# EAGLE design motocontro_rev_4 (EAGLE 9.3.0)
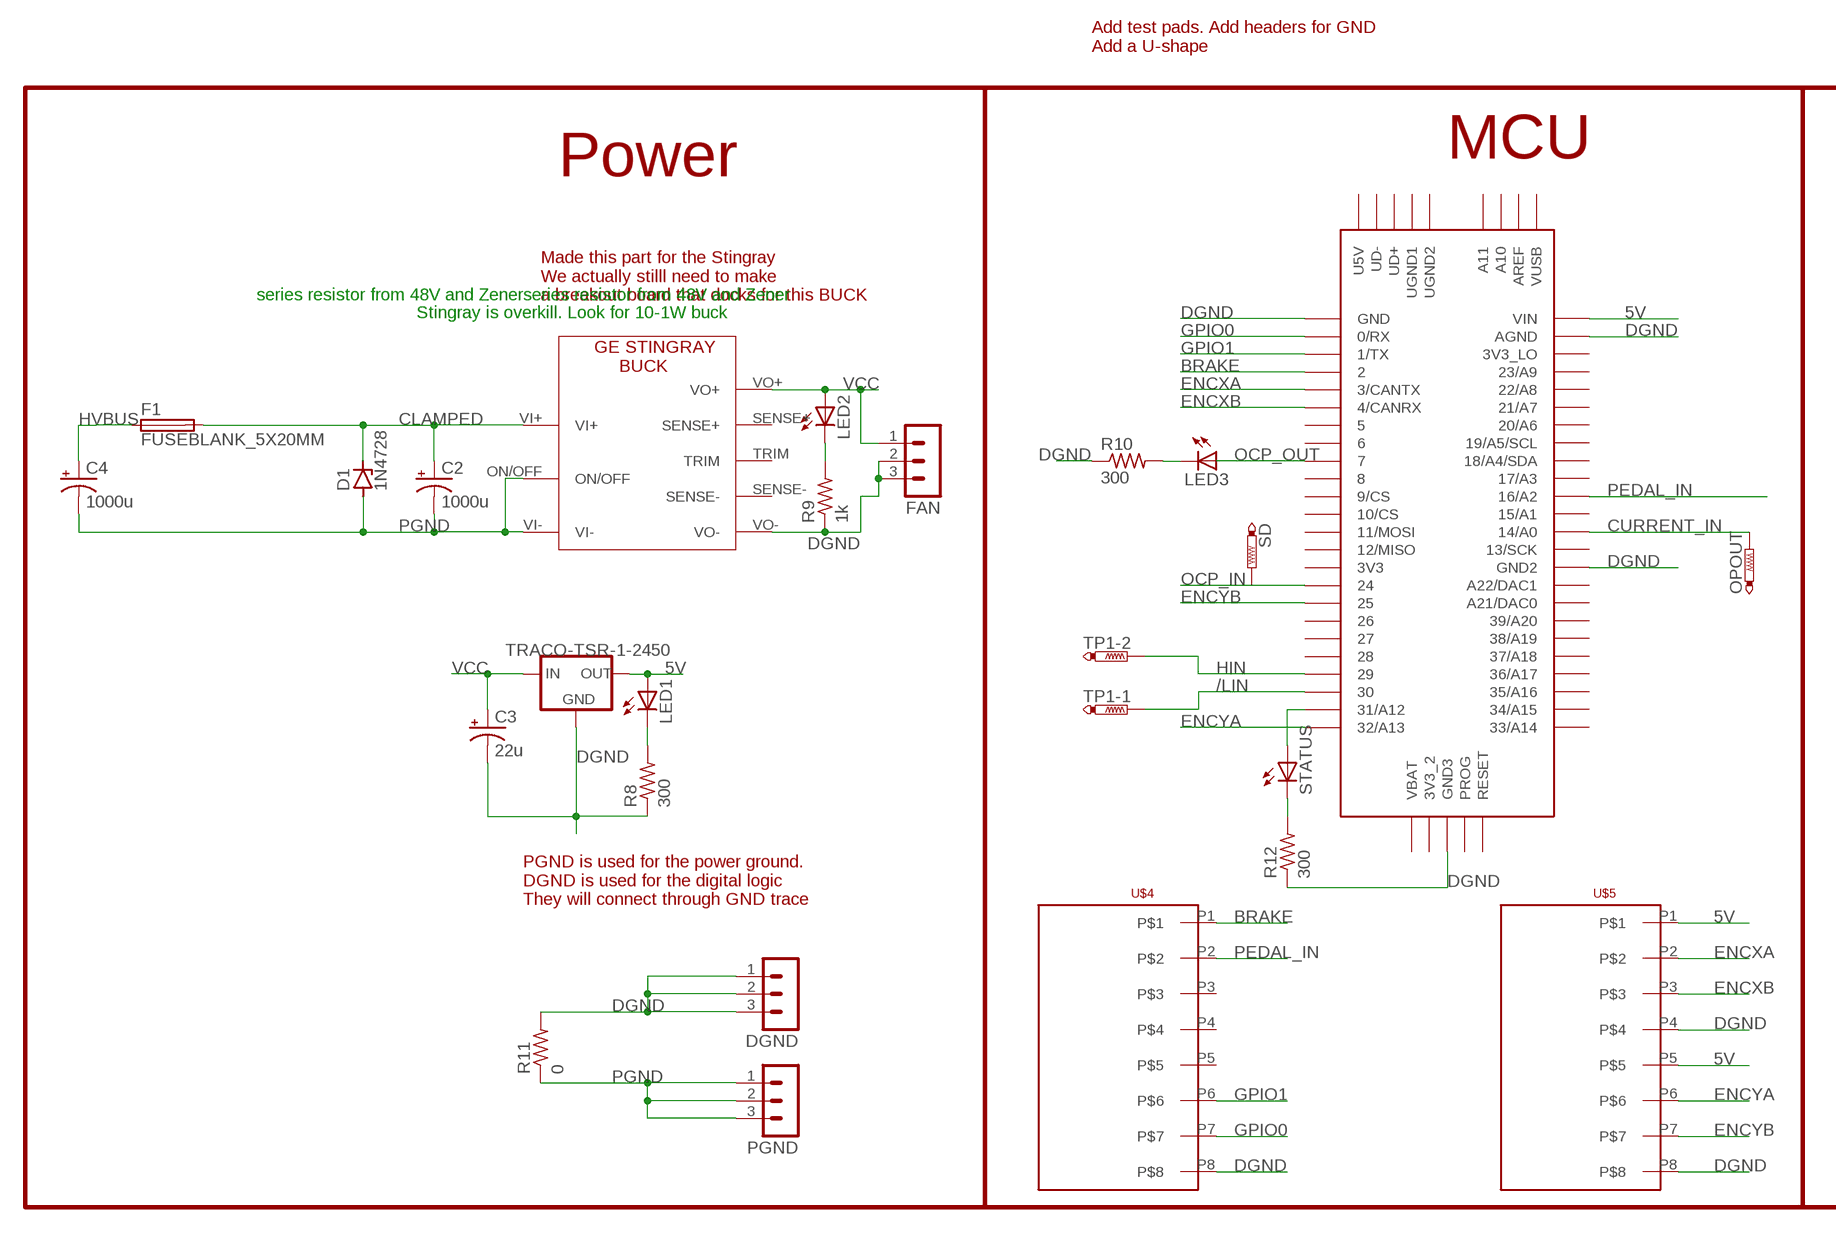
[diagram p0: schematic, sheet 1, part 1 of 2]
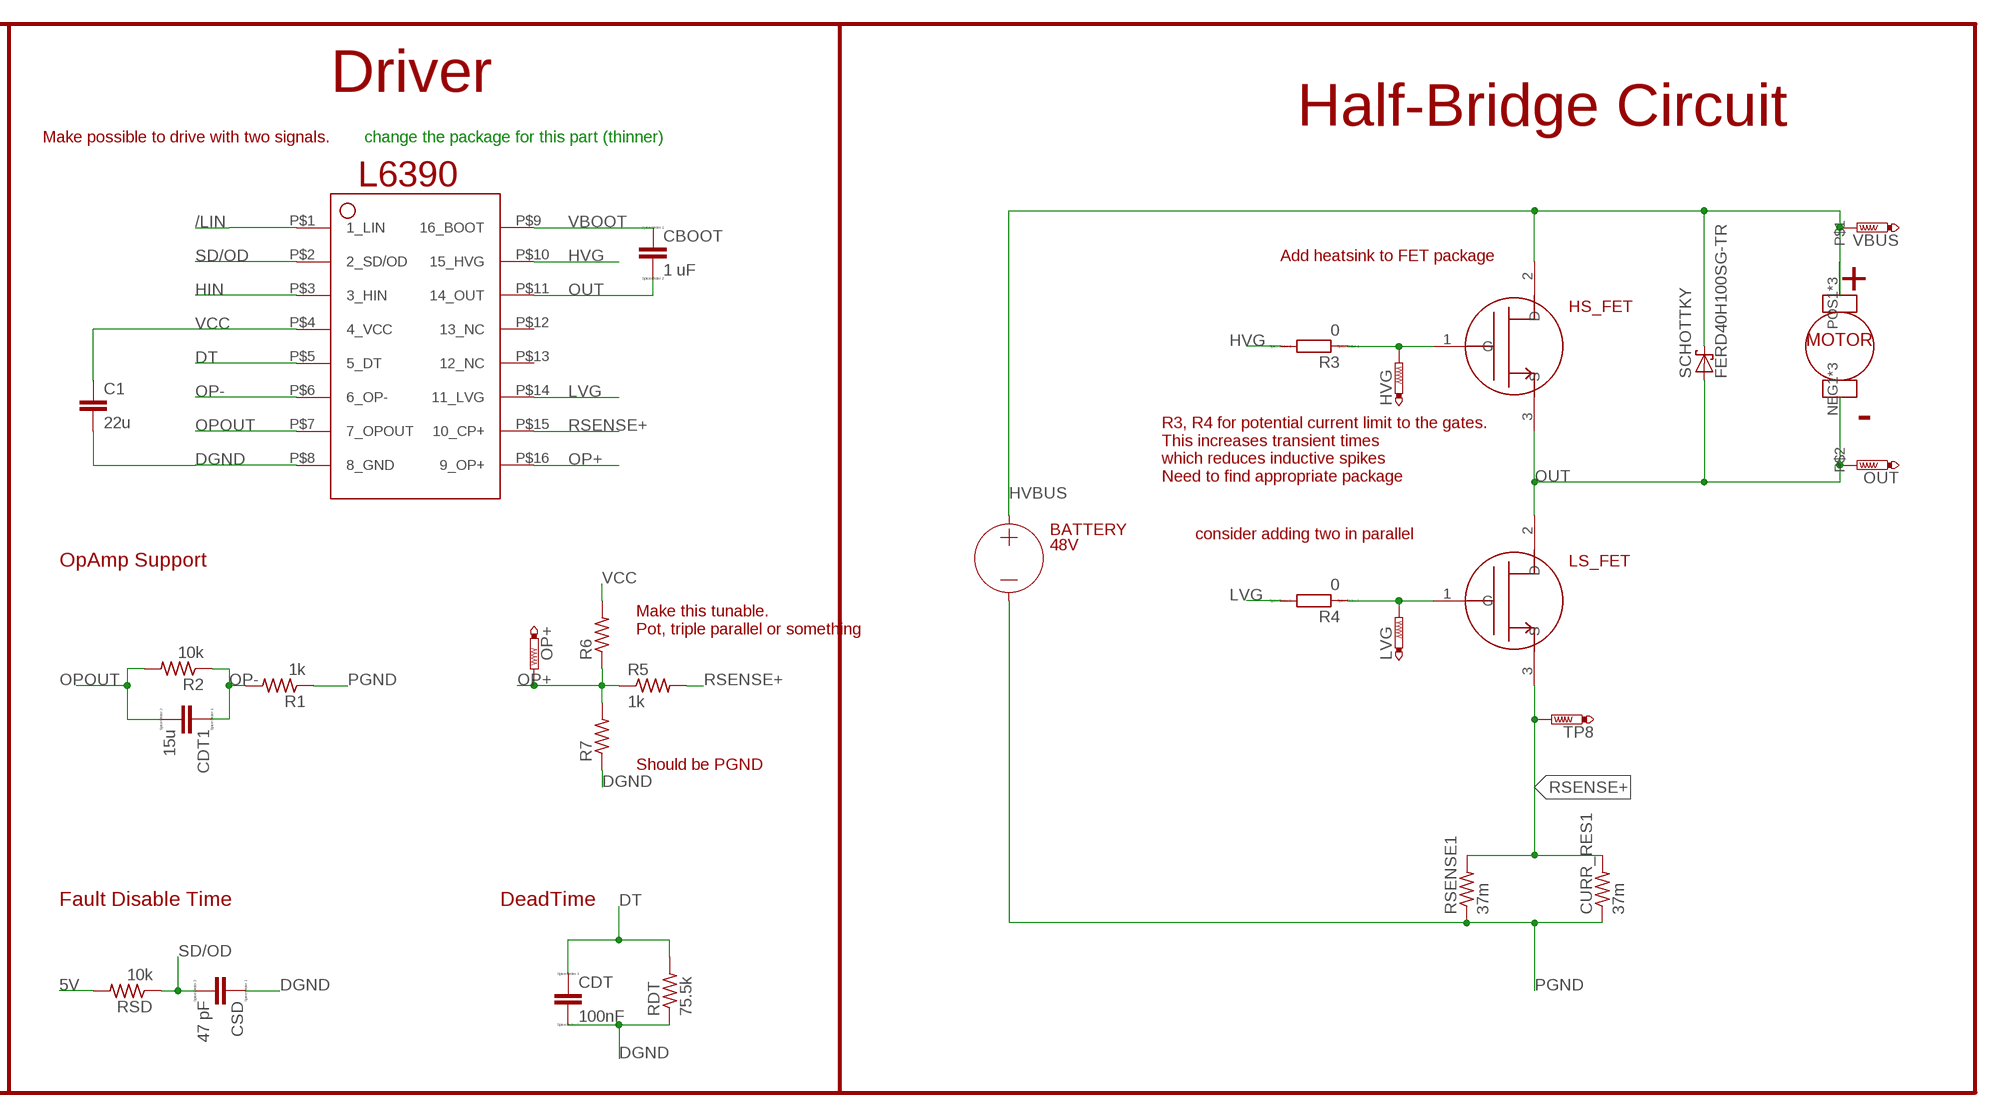
[diagram p1: schematic, sheet 1, part 2 of 2]

## Parts
BATTERY  48V  BATTERY  [SB50POWER_CLAW]
C1  22u  CAPACITOR_0805_M  [RESC0805_M]
C2  1000u  CPOL-USE5-13  [E5-13]
C3  22u  CPOL-US153CLV-0605  [153CLV-0605]
C4  1000u  CPOL-USE10-20  [EB20D]
CBOOT  1 uF  CC1206  [C1206]
CDT  100nF  CC1206  [C1206]
CDT1  15u  CC1206  [C1206]
CSD  47 pF  CC1206  [C1206]
CURR_RES1  37m  RESSENSE_2818  [2818_WITH_VIA]
D1  1N4728  [DO41Z10]
DGND  MA03-1  [MA03-1]
F1  FUSEBLANK_5X20MM  [FUSE_HOLDER_5X20MM]
FAN  MA03-1  [MA03-1]
HS_FET  FDB86360_NFETTO263/D2PAK  [TO-263/D2PAK]
HVG  PTR1B1,27  [B1,27]
LDO  TRACO-TSR-1-2450  [SIP3]
LED1  LEDCHIP-LED0805  [CHIP-LED0805]
LED2  LEDCHIP-LED0805  [CHIP-LED0805]
LED3  LEDCHIP-LED0805  [CHIP-LED0805]
LS_FET  FDB86360_NFETTO263/D2PAK  [TO-263/D2PAK]
LVG  PTR1B1,27  [B1,27]
MOTOR  MOTOR  [SB50POWER_CLAW]
OP+  PTR1B1,27  [B1,27]
OPOUT  PTR1B1,27  [B1,27]
OUT  PTR1B1,27  [B1,27]
PGND  MA03-1  [MA03-1]
R1  1k  R-US_R0805  [R0805]
R2  10k  R-US_R0805  [R0805]
R3  0  RR2012  [R2012]
R4  0  RR2012  [R2012]
R5  1k  R-US_R0805  [R0805]
R6  R-US_R0805  [R0805]
R7  R-US_R0805  [R0805]
R8  300  R-US_R0805  [R0805]
R9  1k  R-US_R0805  [R0805]
R10  300  R-US_R0805  [R0805]
R11  0  R-US_R0805  [R0805]
R12  300  R-US_R0805  [R0805]
RDT  75.5k  R-US_R0805  [R0805]
RSD  10k  R-US_R0805  [R0805]
RSENSE1  37m  RESSENSE_2818  [2818_WITH_VIA]
SCHOTTKY  FERD40H100SG-TR  [TO-263/D2PAK]
SD  PTR1B1,27  [B1,27]
STATUS  LEDCHIP-LED0805  [CHIP-LED0805]
TP1  PTR2  [P2-38-17]
TP8  PTR1B1,27  [B1,27]
U$1  L6390SO-16NARRROW  [SO-16NARROW]
U$2  TEENSY_3.5/3.6  [TEENSY_3.5/3.6]
U$3  GE_STINGRAY_H  [GE_STINGRAY]
U$4  8-PIN-MOLEX-RA-FEMALE  [8-PIN-MOLEX]
U$5  8-PIN-MOLEX-RA-FEMALE  [8-PIN-MOLEX]
VBUS  PTR1B1,27  [B1,27]

## Nets
5V: LDO.3(OUT) LED1.A RSD.2 U$2.VIN U$5.P1 U$5.P5
/LIN: TP1.TP-1 U$1.P$1(1_LIN) U$2.30
BRAKE: U$2.2 U$4.P1
CLAMPED: C2.+ D1.C F1.2 U$3.VI+
CURRENT_IN: OPOUT.TP U$2.14/A0
DGND: C1.2 C3.- CDT.2 CSD.1 DGND.1 DGND.2 DGND.3 FAN.2 FAN.3 LDO.2(GND) R7.1 R8.1 R9.1 R10.1 R11.2 R12.1 RDT.1 U$1.P$8(8_GND) U$2.AGND U$2.GND U$2.GND2 U$2.GND3 U$3.VO- U$4.P8 U$5.P4 U$5.P8
DT: CDT.1 RDT.2 U$1.P$5(5_DT)
ENCXA: U$2.3/CANTX U$5.P2
ENCXB: U$2.4/CANRX U$5.P3
ENCYA: U$2.32/A13 U$5.P6
ENCYB: U$2.25 U$5.P7
GPIO0: U$2.0/RX U$4.P7
GPIO1: U$2.1/TX U$4.P6
HIN: TP1.TP-2 U$1.P$3(3_HIN) U$2.29
HVBUS: BATTERY.POS1(+) BATTERY.POS2(+) BATTERY.POS3(+) C4.+ F1.1 HS_FET.2(D) MOTOR.POS1 MOTOR.POS2 MOTOR.POS3 SCHOTTKY.2(C) VBUS.TP
HVG: R3.2 U$1.P$10(15_HVG)
LVG: R4.2 U$1.P$14(11_LVG)
N$1: LED1.C R8.2
N$2: HS_FET.1(G) HVG.TP R3.1
N$3: LS_FET.1(G) LVG.TP R4.1
N$4: STATUS.A U$2.31/A12
N$5: R12.2 STATUS.C
N$39: LED2.C R9.2
N$48: LED3.C R10.2
OCP_IN: SD.TP U$2.24
OCP_OUT: LED3.A U$2.7
OP+: OP+.TP R5.1 R6.1 R7.2 U$1.P$16(9_OP+)
OP-: CDT1.1 R1.2 R2.1 U$1.P$6(6_OP-)
OPOUT: CDT1.2 R2.2 U$1.P$7(7_OPOUT)
OUT: CBOOT.2 HS_FET.3(S) LS_FET.2(D) MOTOR.NEG1 MOTOR.NEG2 MOTOR.NEG3 OUT.TP SCHOTTKY.3(A) U$1.P$11(14_OUT)
PEDAL_IN: U$2.16/A2 U$4.P2
PGND: BATTERY.NEG1(-) BATTERY.NEG2(-) BATTERY.NEG3(-) C2.- C4.- CURR_RES1.P1.1 CURR_RES1.P$1 D1.A PGND.1 PGND.2 PGND.3 R1.1 R11.1 RSENSE1.P1.1 RSENSE1.P$1 U$3.ON/OFF U$3.VI-
RSENSE+: CURR_RES1.P2.2 CURR_RES1.P$2 LS_FET.3(S) R5.2 RSENSE1.P2.2 RSENSE1.P$2 TP8.TP U$1.P$15(10_CP+)
SD/OD: CSD.2 RSD.1 U$1.P$2(2_SD/OD)
VBOOT: CBOOT.1 U$1.P$9(16_BOOT)
VCC: C1.1 C3.+ FAN.1 LDO.1(IN) LED2.A R6.2 U$1.P$4(4_VCC) U$3.VO+
Unconnected: U$1.P$12(13_NC) U$1.P$13(12_NC) U$2.3V3 U$2.3V3_2 U$2.3V3_LO U$2.5 U$2.6 U$2.8 U$2.9/CS U$2.10/CS U$2.11/MOSI U$2.12/MISO U$2.13/SCK U$2.15/A1 U$2.17/A3 U$2.18/A4/SDA U$2.19/A5/SCL U$2.20/A6 U$2.21/A7 U$2.21/DAC0(A21/DAC0) U$2.22/A8 U$2.23/A9 U$2.26 U$2.27 U$2.28 U$2.33/A14 U$2.34/A15 U$2.35/A16 U$2.36/A17 U$2.37/A18 U$2.38/A19 U$2.39/A20 U$2.A10 U$2.A11 U$2.A22/DAC1 U$2.AREF U$2.PROG U$2.RESET U$2.U5V U$2.UD+ U$2.UD- U$2.UGND1 U$2.UGND2 U$2.VBAT U$2.VUSB U$3.SENSE+ U$3.SENSE- U$3.TRIM U$4.P3 U$4.P4 U$4.P5

## Notes on the sheet
- Add test pads. Add headers for GND
  Add a U-shape
- Power | MCU | Driver
- Half-Bridge Circuit
- Make possible to drive with two signals. | change the package for this part (thinner)
- series resistor from 48V and Zener | series resistor from 48V and Zener
- Made this part for the Stingray
  We actually stilll need to make
  a breakout board that docks for this BUCK
- Stingray is overkill. Look for 10-1W buck
- Add heatsink to FET package
- R3, R4 for potential current limit to the gates.
  This increases transient times
  which reduces inductive spikes
  Need to find appropriate package
- consider adding two in parallel
- OpAmp Support
- Make this tunable.
  Pot, triple parallel or something
- Should be PGND
- PGND is used for the power ground.
  DGND is used for the digital logic
  They will connect through GND trace
- Fault Disable Time | DeadTime

## Library data of the parts
BATTERY = Rev_motor_controller_3.02:BATTERY
C1 = Nordic_nRF:CAPACITOR: Generic chip capacitor
C2-C4 = adafruit:CPOL-US: POLARIZED CAPACITOR, American symbol
CBOOT CDT CDT1 CSD = eagle-ltspice:C: CAPACITOR, European symbol; SPICEMODEL: NONE; SPICEPREFIX: C
CURR_RES1 RSENSE1 = motocontro_rev_4:RESSENSE_2818
D1 = diode:1N4728: Z DIODE 3.3 V, 1W, 5 percent
DGND FAN PGND = con-lstb:MA03-1: PIN HEADER; OC_FARNELL: unknown; OC_NEWARK: unknown
F1 = fuse:FUSE: Fuse; OC_FARNELL: unknown; OC_NEWARK: unknown
HS_FET LS_FET = motocontro_rev_4:FDB86360_NFET
HVG LVG OP+ OPOUT OUT SD TP8 VBUS = testpad:PTR1: TEST PIN
LDO = r-78xx_10:TRACO-TSR-1-2450: An LDO from TRACO POWER
LED1-LED3 STATUS = adafruit:LED: LED OSRAM: - CHIPLED LG R971, LG N971, LY N971, LG Q971, LY Q971, LO R971, LY R971 LH N974, LH R974 LS Q976, LO Q976, LY Q976 LO Q996 - Hyper CHIPLED LW Q18S LB Q993, LB Q99A, LB R99A - SideLED LS A670, LO A670, LY A670, LG A670, LP A670 LB A673, LV A673, LT A673, LW A673 LH A674 LY A675 LS A676, LA A676, LO A676, LY A676, LW A676 LS A679, LY A679, LG A679 - Hyper Micro SIDELED® LS Y876, LA Y876, LO Y876, LY Y876 LT Y87S - SmartLED LW L88C, LW L88S LB L89C, LB L89S, LG L890 LS L89K, LO L89K, LY L89K LS L896, LA L896, LO L896, LY L896 - TOPLED LS T670, LO T670, LY T670, LG T670, LP T670 LSG T670, LSP T670, LSY T670, LOP T670, LYG T670 LG T671, LOG T671, LSG T671 LB T673, LV T673, LT T673, LW T673 LH T674 LS T676, LA T676, LO T676, LY T676, LB T676, LH T676, LSB T676, LW T676 LB T67C, LV T67C, LT T67C, LS T67K, LO T67K, LY T67K, LW E67C LS E67B, LA E67B, LO E67B, LY E67B, LB E67C, LV E67C, LT E67C LW T67C LS T679, LY T679, LG T679 LS T770, LO T770, LY T770, LG T770, LP T770 LB T773, LV T773, LT T773, LW T773 LH T774 LS E675, LA E675, LY E675, LS T675 LS T776, LA T776, LO T776, LY T776, LB T776 LHGB T686 LT T68C, LB T68C - Hyper Mini TOPLED® LB M676 - Mini TOPLED Santana® LG M470 LS M47K, LO M47K, LY M47K Source: http://www.osram.convergy.de/
MOTOR = Rev_motor_controller_3.02:MOTOR
R1 R2 R5-R12 RDT RSD = adafruit:R-US_: RESISTOR, American symbol
R3 R4 = eagle-ltspice:R: RESISTOR, European symbol; SPICEMODEL: NONE; SPICEPREFIX: R
SCHOTTKY = motocontro_rev_4:FERD40H100SG-TR: An IF= 40A, VF = 375mV-700mV, schottky diode in D2PAK
TP1 = testpad:PTR2: TEST PIN
U$1 = master_library:L6390
U$2 = Teensy356:TEENSY_3.5/3.6
U$3 = motocontro_rev_4:GE_STINGRAY_H
U$4 U$5 = master_library:8-PIN-MOLEX-RA-FEMALE

## Board
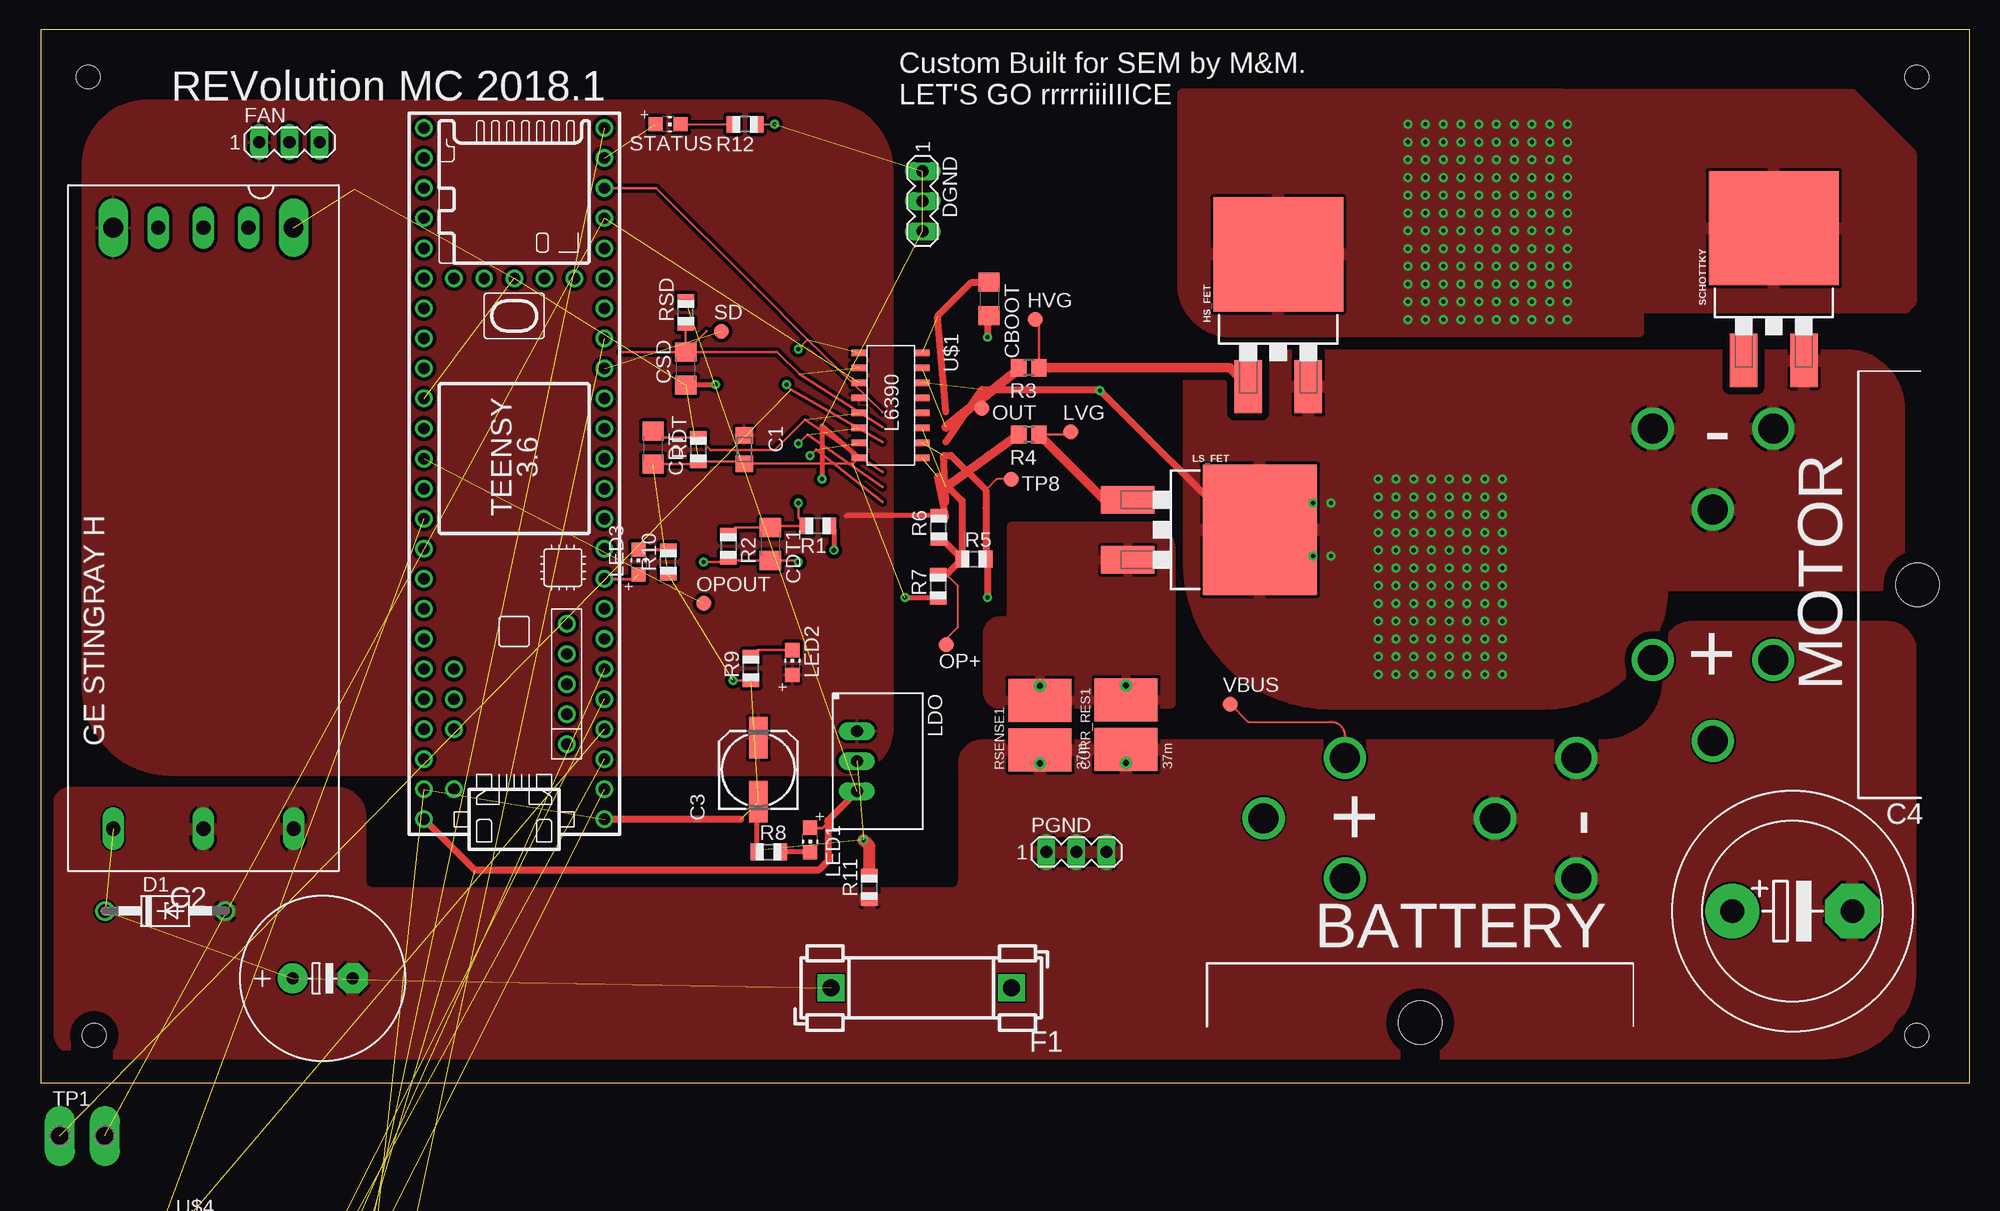
[diagram p2: board, top side]
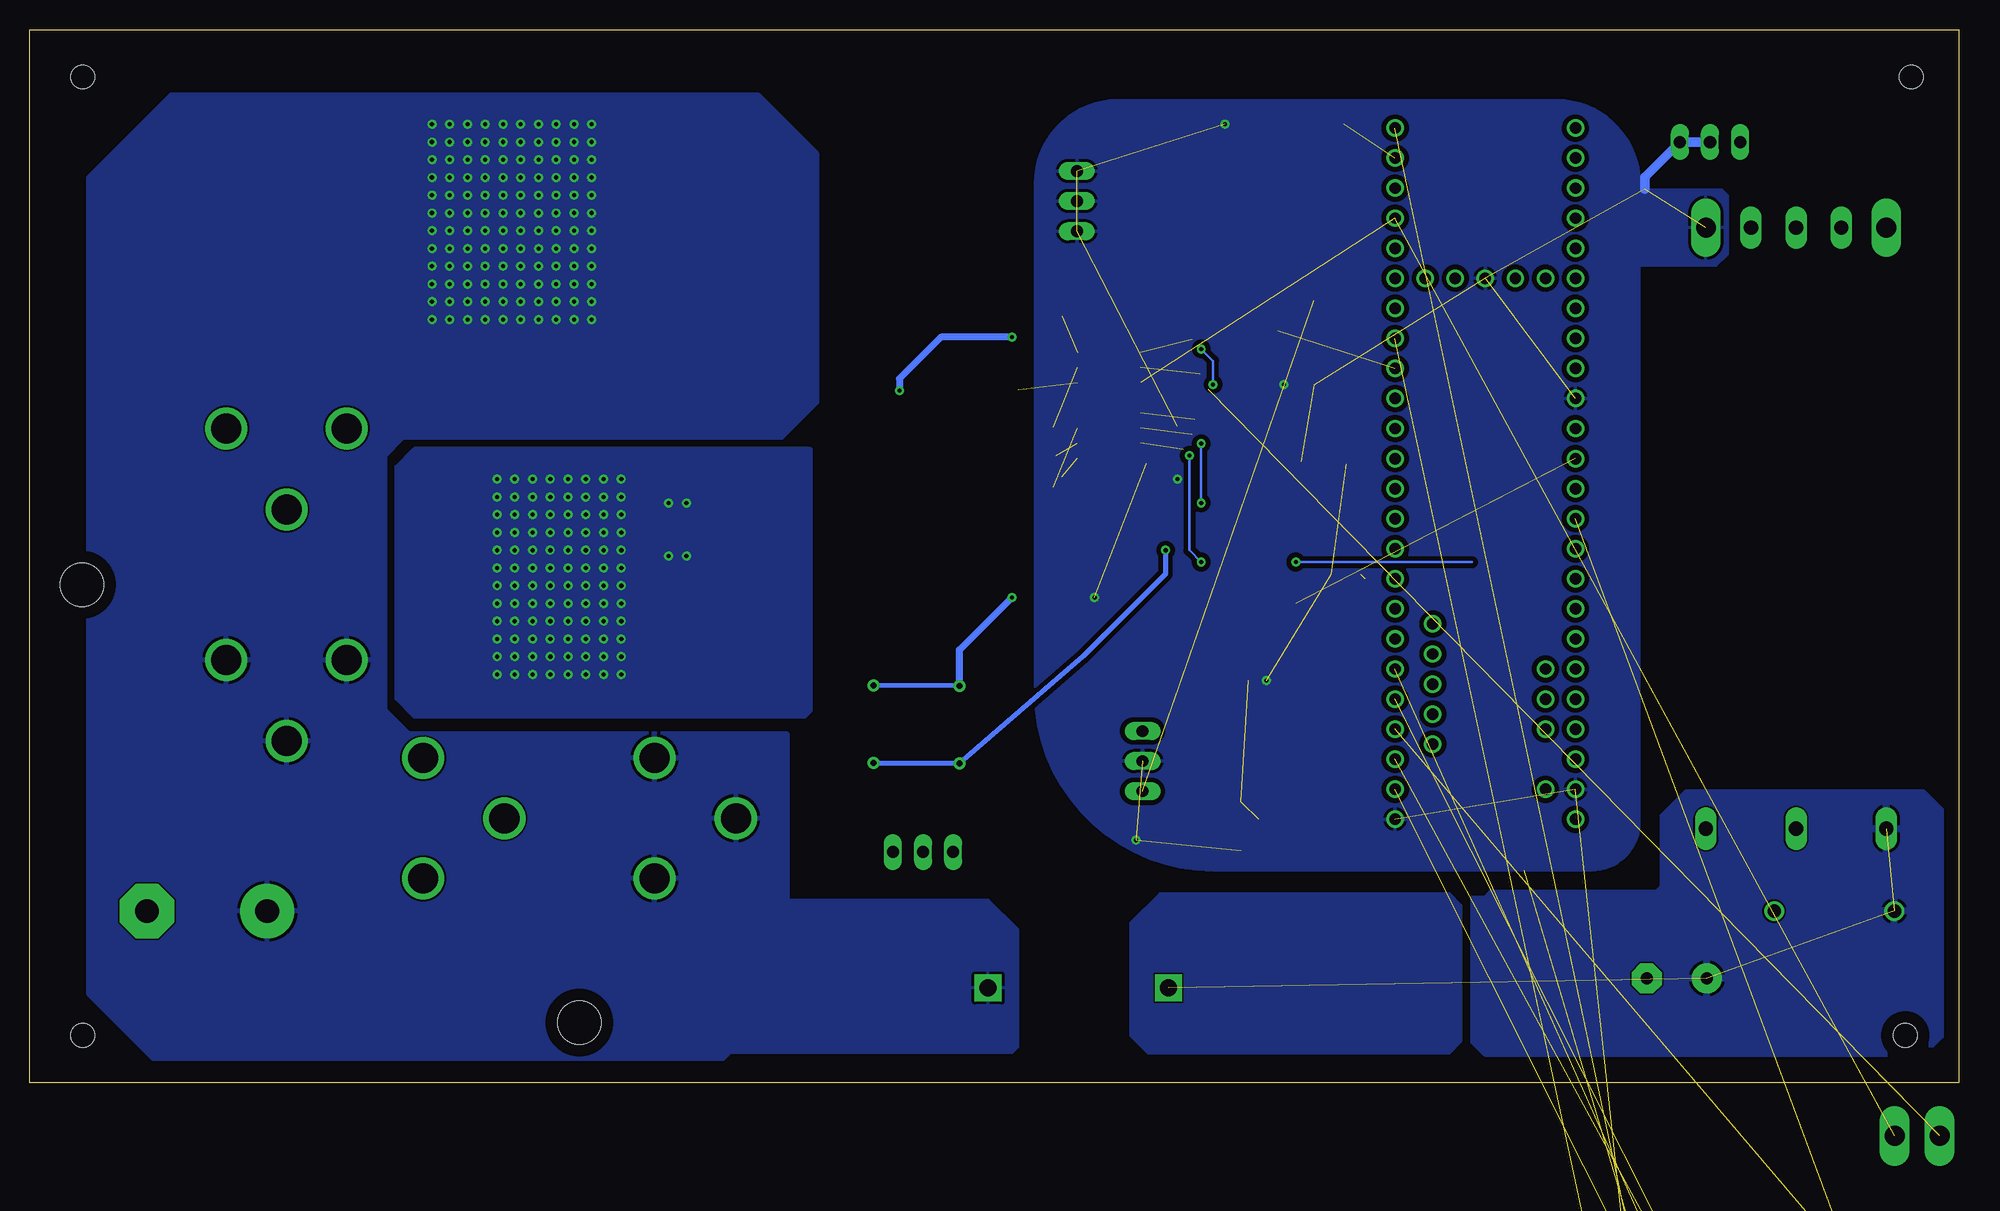
[diagram p3: board, bottom side, seen from below]

Size 163 x 89 mm. Coordinates in mm from the lower left corner, seen from the top.
Outline: 0,0 163,0 163,89 0,89 0,0
Copper layers (1*16): Top 0.035mm / dielectric 1.5mm / Bottom 0.035mm
Design rules "default": minimum track width 6mil, minimum drill 0.35mm, track to track 6mil, track to pad 6mil, pad to pad 6mil, via to via 6mil, smd to smd 6mil, copper to edge 40mil, drill to drill 6mil, minimum pad ring 10mil, minimum via ring 8mil, stop-mask expansion 4mil, vias tented up to drill 0mil, thermal gap 10mil
Holes 2 mm at 4,85 4.5,4 158.5,4 158.5,85

### Footprints (pad centres in the part's own frame; a part is rotated, then mirrored left to right if it is on the bottom)
SB50POWER_CLAW = drill 2.54: NEG1 -22.35,13.21; NEG2 -17.27,6.35; NEG3 -12.19,13.21; POS1 -22.35,-6.35; POS2 -17.27,-13.21; POS3 -12.19,-6.35 | hole 3.66: 0,0
RESC0805_M = smd 1.4 x 1.45: 1 -1.2,0; 2 1.2,0
E5-13 = drill 1.016 pad 2.54: + -2.54,0 | drill 1.016 pad 2.54 octagon: - 2.54,0
153CLV-0605 = smd 3.5 x 1.6: + 2.7,0; - -2.7,0
EB20D = drill 2.007 pad 4.597: + -5.08,0 | drill 2.007 pad 4.597 octagon: - 5.08,0
C1206 = smd 1.6 x 1.8: 1 -1.4,0; 2 1.4,0
2818_WITH_VIA = drill 0.5: P1.1 0.66,2.665; P2.2 7.21,2.665 | smd 3.63 x 5.33: P$1 1.815,2.665; P$2 6.005,2.665
DO41Z10 = drill 1.118: A 5.08,0; C -5.08,0
MA03-1 = drill 1.016 long: 1 -2.54,0; 2 0,0; 3 2.54,0
FUSE_HOLDER_5X20MM = drill 1.422 pad 2.286 square: 1 0,0; 2 15.24,0
TO-263/D2PAK = smd 2.32 x 4.5: 1 -2.54,-7.045; 3 2.54,-7.045 | smd 11 x 9.65: 2 0,4.125
B1,27 = smd 1.27 x 1.27: TP 0,0
SIP3 = drill 1 long: 1 -2.54,0; 2 0,0; 3 2.54,0
CHIP-LED0805 = smd 1.2 x 1.2: A 0,-1.05; C 0,1.05
R0805 = smd 1.1 x 1.4: 1 -1,0; 2 1,0
R2012 = smd 1.3 x 1.5: 1 -0.85,0; 2 0.85,0
P2-38-17 = drill 1.702 pad 2.121 long: TP-1 -1.905,0; TP-2 1.905,0
SO-16NARROW = smd 0.55 x 1.25: P$1 0,0; P$2 1.27,0; P$3 2.54,0; P$4 3.81,0; P$5 5.08,0; P$6 6.35,0; P$7 7.62,0; P$8 8.89,0; P$9 0,5.35; P$10 1.27,5.35; P$11 2.54,5.35; P$12 3.81,5.35; P$13 5.08,5.35; P$14 6.35,5.35; P$15 7.62,5.35; P$16 8.89,5.35
TEENSY_3.5/3.6 = drill 0.965: 0/RX -25.4,-7.62; 1/TX -22.86,-7.62; 2 -20.32,-7.62; 3/CANTX -17.78,-7.62; 3V3 7.62,-7.62; 3V3_2 17.78,-2.54; 3V3_LO -22.86,7.62; 4/CANRX -15.24,-7.62; 5 -12.7,-7.62; 6 -10.16,-7.62; 7 -7.62,-7.62; 8 -5.08,-7.62; 9/CS -2.54,-7.62; 10/CS 0,-7.62; 11/MOSI 2.54,-7.62; 12/MISO 5.08,-7.62; 13/SCK 5.08,7.62; 14/A0 2.54,7.62; 15/A1 0,7.62; 16/A2 -2.54,7.62; 17/A3 -5.08,7.62; 18/A4/SDA -7.62,7.62; 19/A5/SCL -10.16,7.62; 20/A6 -12.7,7.62; 21/A7 -15.24,7.62; 21/DAC0 12.7,7.62; 22/A8 -17.78,7.62; 23/A9 -20.32,7.62; 24 10.16,-7.62; 25 12.7,-7.62; 26 15.24,-7.62; 27 17.78,-7.62; 28 20.32,-7.62; 29 22.86,-7.62; 30 25.4,-7.62; 31/A12 27.94,-7.62; 32/A13 30.48,-7.62; 33/A14 30.48,7.62; 34/A15 27.94,7.62; 35/A16 25.4,7.62; 36/A17 22.86,7.62; 37/A18 20.32,7.62; 38/A19 17.78,7.62; 39/A20 15.24,7.62; A10 -17.78,5.08; A11 -15.24,5.08; A22/DAC1 10.16,7.62; AGND -25.4,7.62; AREF -20.32,5.08; GND -27.94,-7.62; GND2 7.62,7.62; GND3 17.78,0; PROG 17.78,2.54; RESET 17.78,5.08; U5V -21.59,-4.445; UD+ -16.51,-4.445; UD- -19.05,-4.445; UGND1 -13.97,-4.445; UGND2 -11.43,-4.445; VBAT 17.78,-5.08; VIN -27.94,7.62; VUSB -25.4,5.08
GE_STINGRAY = drill 1.2 long: ON/OFF 0,7.62; SENSE+ 50.8,11.43; SENSE- 50.8,3.81; TRIM 50.8,7.62; VI+ 0,15.24; VI- 0,0 | drill 1.65 long: VO+ 50.8,15.24; VO- 50.8,0
8-PIN-MOLEX = drill 1.02 square: P1 2.248,13.16; P2 5.748,13.16; P3 9.248,13.16; P4 12.748,13.16; P5 16.248,13.16; P6 19.748,13.16; P7 23.248,13.16; P8 26.748,13.16 | hole 3.05: 4,5.25; 25,5.25

### Placement (x,y rotation side)
BATTERY  116.53,5.08 270 top
C1  59.43,53.51 270 top
C2  23.81,8.81 0 top
C3  60.62,26.44 90 top
C4  148,14.5 0 top
CBOOT  80.12,66.24 270 top
CDT  51.72,53.67 270 top
CDT1  61.64,45.51 270 top
CSD  54.49,60.34 90 top
CURR_RES1  94.36,26.34 90 top
D1  10.5,14.5 0 top
DGND  74.5,74.5 270 top
F1  82,8 180 top
FAN  21,79.5 0 top
HS_FET  104.56,65.88 0 top
HVG  84,64.5 0 top
LDO  68.95,27.17 270 top
LED1  65,20.5 180 top
LED2  63.5,35.5 0 top
LED3  50.5,44 0 top
LS_FET  98.88,46.73 270 top
LVG  87,55 0 top
MOTOR  158.56,42.08 0 top
OP+  76.5,37 0 top
OPOUT  56,40.5 0 top
OUT  79.5,57 0 top
PGND  87.5,19.5 0 top
R1  65.65,47.06 180 top
R2  58.1,45.34 270 top
R3  83.49,60.42 180 top
R4  83.49,54.77 180 top
R5  78.84,44.25 0 top
R6  75.85,46.93 90 top
R7  75.83,41.95 90 top
R8  61.5,19.5 0 top
R9  60,35 90 top
R10  53,44 90 top
R11  70,16.5 90 top
R12  59.5,81 180 top
RDT  55.56,53.51 90 top
RSD  54.48,65.1 90 top
RSENSE1  87.09,26.31 90 top
SCHOTTKY  146.43,68.09 0 top
SD  57.5,63.5 0 top
STATUS  53,81 270 top
TP1  3.5,-4.5 0 top  (outside the outline)
TP8  82,51 0 top
U$1  69.12,61.69 270 top
U$2  39.99,50.2 90 top
U$3  21.35,21.46 90 top
U$4  0.5,-36 0 top  (outside the outline)
U$5  0,-64 0 top  (outside the outline)
VBUS  100.5,32 0 top

### Tracks (layer width: path | path; a pad name or v marks a point on that pad's centre or on a via)
5V  (3 unrouted)
  Top 0.254: LED1.A 66.05,21.55 66.5,22
  Top 0.406: 66.5,22.18 66.5,22
  Top 0.61: LDO.3 66.5,22.18 | 66.5,22 66.5,18.75 65.7,17.94 36.69,17.94 U$2.VIN
/LIN  (via drill 0.35)  (2 unrouted)
  Top 0.2: U$2.30 52,75.6 60.3,67.3 64.8,62.8 | 64.8,62.8 71.12,56.69 | 71.12,54.15 63.41,58.59 v63,59 | v64,62 64.8,62.8
  Bottom 0.2: v63,59 63,61 v64,62
BRAKE  (1 unrouted)
CLAMPED  (3 unrouted)
  pour Bottom: 41,15.5 41,3.5 40,2.5 3,2.5 1.5,4 1.5,23 3,24.5 23,24.5 25,22.5 25,16.5 25.5,16 38,16 39.5,16 40,15.5
CURRENT_IN  (1 unrouted)
DGND  (via drill 0.35)  (21 unrouted)
  Top 0.152: R12.1 v62,81
  Top 0.2: CDT.2 55.32,52.27 RDT.1 59.23,52.51 C1.2 68.61,52.31 U$1.P$8 | R8.1 60.62,19.62 | R9.1 v58.5,34
  Top 0.406: R7.1 72.95,40.95 v73,41 | U$1.P$8 66,55.51 v66,51 | CSD.1 54.55,59 v57,59 | R8.1 60.5,23.62
  Top 0.61: 59.14,22.26 U$2.GND
  Top 1.016: v69.5,20.5 70,20 R11.2
  Bottom 0.813: FAN.2 FAN.3 26.5,76.54 26.5,75.5
  pour Bottom (isolate 0.406): 31,18 63,18 arc90 78,33 78,76 arc90 71,83 34,83 arc90 27,76 27,22 arc90
  pour Bottom: 20,75.5 19.5,75 19.5,70 20.5,69 28,69 29.5,70.5 29.5,74.5 28.5,75.5
DT  (1 unrouted)
  Top 0.2: CDT.1 52.28,54.51 RDT.2 56.6,53.47 61.98,53.47 64.56,56.05 71.12,51.61
ENCXA  (1 unrouted)
ENCXB  (1 unrouted)
ENCYA  (1 unrouted)
ENCYB  (1 unrouted)
FUSED
  pour Bottom: 70,13.5 70,4 68.5,2.5 43,2.5 42,3.5 42,4 42,15 43,16 67.5,16
GPIO0  (1 unrouted)
GPIO1  (1 unrouted)
HIN  (2 unrouted)
HVBUS  (via drill 0.35)
  Top 0.152: VBUS.TP 102,30.5 109,30.5 arc-90 110.18,29.32 BATTERY.POS1
  other vias: 115.5,81 117,81 118.5,81 120,81 121.5,81 123,81 124.5,81 126,81 127.5,81 129,81 115.5,79.5 117,79.5 118.5,79.5 120,79.5 121.5,79.5 123,79.5 124.5,79.5 126,79.5 127.5,79.5 129,79.5 115.5,78 117,78 118.5,78 120,78 121.5,78 123,78 124.5,78 126,78 127.5,78 129,78 115.5,76.5 117,76.5 118.5,76.5 120,76.5 121.5,76.5 123,76.5 124.5,76.5 126,76.5 127.5,76.5 129,76.5 115.5,75 117,75 118.5,75 120,75 121.5,75 123,75 124.5,75 126,75 127.5,75 129,75 115.5,73.5 117,73.5 118.5,73.5 120,73.5 121.5,73.5 123,73.5 124.5,73.5 126,73.5 127.5,73.5 129,73.5 115.5,72 117,72 118.5,72 120,72 121.5,72 123,72 124.5,72 126,72 127.5,72 129,72 115.5,70.5 117,70.5 118.5,70.5 120,70.5 121.5,70.5 123,70.5 124.5,70.5 126,70.5 127.5,70.5 129,70.5 115.5,67.5 117,67.5 118.5,67.5 120,67.5 121.5,67.5 123,67.5 124.5,67.5 126,67.5 127.5,67.5 129,67.5 115.5,64.5 117,64.5 118.5,64.5 120,64.5 121.5,64.5 123,64.5 124.5,64.5 126,64.5 127.5,64.5 129,64.5 115.5,66 117,66 118.5,66 120,66 121.5,66 123,66 124.5,66 126,66 127.5,66 129,66 115.5,69 117,69 118.5,69 120,69 121.5,69 123,69 124.5,69 126,69 127.5,69 129,69
  pour Top (isolate 0.61): 96.5,83.5 96.5,67.5 arc90 100.5,63.5 135,63.5 135,77 arc90 128.5,83.5
  pour Top: 128,83.5 153,83.5 158,78.5 158,66 157.5,65.5 132.5,65.5 132.5,79
  pour Bottom: 99,29.5 99,7.5 104.5,2 152.5,2 158,7.5 158,76.5 151,83.5 101.5,83.5 96.5,78.5 96.5,57.5 99.5,54.5 131.5,54.5 133,53 133,31.5 131,29.5
  pour Bottom: 99,15.5 82,15.5 79.5,13 79.5,3 80,2.5 105.5,2.5 105.5,15 99.5,15
HVG  (1 unrouted)
  Top 0.813: 76.47,55.42 82.08,59.87 R3.2
LVG  (1 unrouted)
  Top 0.813: 76.47,50.34 82.62,54.78 R4.2
N$1
  Top 0.406: LED1.C 64.95,19.5 R8.2
N$2
  Top 0.2: R3.1 84.34,64.16 HVG.TP
  Top 0.813: R3.1 100.44,60.42 HS_FET.1
N$3
  Top 0.2: LVG.TP 86.77,54.77 R4.1
  Top 0.813: R4.1 89.84,49.27 LS_FET.1
N$4  (1 unrouted)
N$5
  Top 0.152: STATUS.C R12.2
N$39
  Top 0.2: LED2.C 60.55,36.55 R9.2
N$48
  Top 0.254: LED3.C 52.95,45.05 R10.2
OCP_IN  (1 unrouted)
OCP_OUT  (1 unrouted)
  Top 0.254: U$2.7 50.13,42.58
OP+  (1 unrouted)
  Top 0.152: OP+.TP 76.5,37.5 77.5,38.5 77.5,41.98 76.53,42.95
  Top 0.61: 76.47,47.8 75.77,51.23 77.84,49.16 R5.1 | R5.1 76.53,42.95 R7.2 | R5.1 76.16,45.93 R6.1
OP-  (via drill 0.35)  (1 unrouted)
  Top 0.2: 71.12,50.34 64.78,54.78 v64,54 | R2.1 58.67,46.91 CDT1.1 61.79,47.06 R1.2 64,47.71 v64,49
  Bottom 0.2: v64,54 v64,49
OPOUT  (via drill 0.35)  (1 unrouted)
  Top 0.2: 71.12,49.07 65.52,53.52 v65,53 | v64,44 63.89,44.11 CDT1.2 58.33,44.11 R2.2 arc-90 57.76,44 v56,44
  Bottom 0.2: v64,44 65,45 v65,53 | v56,44 41.11,44
OUT  (via drill 0.35)  (1 unrouted)
  Top 0.2: OUT.TP 79.5,58.59
  Top 0.406: CBOOT.2 80,64.84 | 89.41,58.59 v89.5,58.5 | 101.27,46.73 LS_FET.2
  Top 0.61: 76.47,54.15 79.5,58.59 89.41,58.59 | 80,64.84 v80,63 | v89.5,58.5 101.27,46.73
  Bottom 0.61: v80,63 86,63 89.5,59.5 v89.5,58.5
  other vias: 113,51 114.5,51 116,51 117.5,51 119,51 120.5,51 122,51 123.5,51 113,34.5 114.5,34.5 116,34.5 117.5,34.5 119,34.5 120.5,34.5 122,34.5 123.5,34.5 113,36 114.5,36 116,36 117.5,36 119,36 120.5,36 122,36 123.5,36 113,37.5 114.5,37.5 116,37.5 117.5,37.5 119,37.5 120.5,37.5 122,37.5 123.5,37.5 113,39 114.5,39 116,39 117.5,39 119,39 120.5,39 122,39 123.5,39 113,40.5 114.5,40.5 116,40.5 117.5,40.5 119,40.5 120.5,40.5 122,40.5 123.5,40.5 113,42 114.5,42 116,42 117.5,42 119,42 120.5,42 122,42 123.5,42 113,43.5 114.5,43.5 116,43.5 117.5,43.5 119,43.5 120.5,43.5 122,43.5 123.5,43.5 113,45 114.5,45 116,45 117.5,45 119,45 120.5,45 122,45 123.5,45 113,46.5 114.5,46.5 116,46.5 117.5,46.5 119,46.5 120.5,46.5 122,46.5 123.5,46.5 113,48 114.5,48 116,48 117.5,48 119,48 120.5,48 122,48 123.5,48 113,49.5 114.5,49.5 116,49.5 117.5,49.5 119,49.5 120.5,49.5 122,49.5 123.5,49.5 107.5,44.5 109,44.5 109,49 107.5,49
  pour Top (isolate 0.61): 97,61.5 152.5,61.5 arc-90 157,57 157,44 arc-90 155,42 137,42 arc-90 127,32 109,32 arc-90 97,44
  pour Bottom: 97,53.5 130.5,53.5 132,52 132,32.5 130.5,31 97.5,31 97,31.5
PEDAL_IN  (1 unrouted)
PGND  (via drill 0.35)
  Top 0.406: R1.1 67,46.71 v67,45
  Bottom 0.406: v67,45 67,43 74,36 RSENSE1.P1.1 91.69,26.97 CURR_RES1.P1.1
  pour Top: 1.5,23.5 1.5,4.5 arc90 3.5,2.5 151,2.5 arc90 158,9.5 158,36.5 arc90 156,38.5 139.5,38.5 arc90 137.5,36.5 137.5,34 arc-90 132,28.5 79.5,28.5 arc90 78,27 78,17 arc-90 77,16 28,16 arc-90 27,17 27,22.5 arc90 25,24.5 2.5,24.5 arc90
RSENSE+  (via drill 0.35)  (1 unrouted)
  Top 0.152: TP8.TP 80.77,51 79.84,50.08
  Top 0.61: 76.47,49.07 76.28,53 76.92,53 79.84,50.08 79.84,48.56 R5.2 80,44.09 v80,41
  Bottom 0.406: RSENSE1.P2.2 CURR_RES1.P2.2
  Bottom 0.61: RSENSE1.P2.2 84.42,36.58 v80,41
  pour Top: 95.5,32 95.5,45 arc90 93.5,47 82,47 82,39 81,39 arc90 80,38 80,33 arc90 81,32
SD/OD  (1 unrouted)
  Top 0.2: 71.12,55.42 64.09,59.87 62.21,61.74 CSD.2 | RSD.1 54.49,64.09 CSD.2 | CSD.2 48.99,61.74 | CSD.2 56.25,63.5
VBOOT  (1 unrouted)
  Top 0.61: 76.47,56.69 75.77,64.77 78.64,67.64 CBOOT.1
VCC
  Top 0.406: R6.2 68.07,47.93
  pour Top (isolate 0.305): 66,83 9,83 arc90 3.5,77.5 3.5,33.5 arc90 11,26 68,26 arc90 72,30 72,77 arc90

### Text on the board
tPlace: Custom Built for SEM by M&M. / LET'S GO rrrrriiiIIICE
tNames: REVolution MC 2018.1
tValues: 2mm